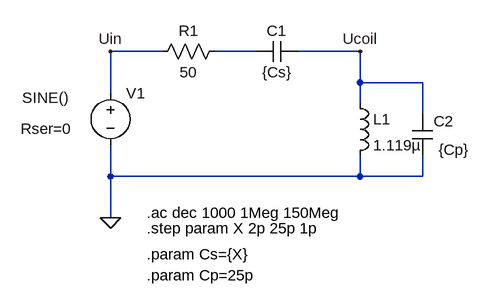
[diagram p0: schematic SeriesRLC-SeriesR.asc]
SeriesRLC-SeriesR.asc, the LTspice schematic file:
Version 4
SHEET 1 880 708
WIRE 224 48 144 48
WIRE 368 48 304 48
WIRE 528 48 432 48
WIRE 528 96 528 48
WIRE 624 96 528 96
WIRE 144 112 144 48
WIRE 528 128 528 96
WIRE 624 144 624 96
WIRE 144 240 144 192
WIRE 528 240 528 208
WIRE 528 240 144 240
WIRE 624 240 624 208
WIRE 624 240 528 240
WIRE 144 304 144 240
FLAG 144 304 0
FLAG 528 48 Ucoil
FLAG 144 48 Uin
SYMBOL ind 512 112 R0
SYMATTR InstName L1
SYMATTR Value 1.119µ
SYMATTR SpiceLine Rser=0.1 Cpar=38f
SYMBOL voltage 144 96 R0
WINDOW 39 -138 71 Left 2
WINDOW 3 -136 23 Left 2
SYMATTR SpiceLine Rser=0
SYMATTR Value SINE()
SYMATTR Value2 AC 1
SYMATTR InstName V1
SYMBOL cap 432 32 R90
WINDOW 0 0 32 VBottom 2
WINDOW 3 32 32 VTop 2
SYMATTR InstName C1
SYMATTR Value {Cs}
SYMBOL cap 640 208 R180
WINDOW 0 -32 53 Left 2
WINDOW 3 -56 9 Left 2
SYMATTR InstName C2
SYMATTR Value {Cp}
SYMATTR SpiceLine Rser=0.1
SYMBOL res 320 32 R90
WINDOW 0 0 56 VBottom 2
WINDOW 3 32 56 VTop 2
SYMATTR InstName R1
SYMATTR Value 50
TEXT 200 296 Left 2 !.ac dec 1000 1Meg 150Meg
TEXT 200 320 Left 2 !.step param X 2p 25p 1p
TEXT 200 360 Left 2 !.param Cs={X}
TEXT 200 392 Left 2 !.param Cp=25p

The netlist it stands for:
* SeriesRLC-SeriesR.asc
L1 Ucoil 0 1.119µ Rser=0.1 Cpar=38f
V1 Uin 0 SINE() AC 1 Rser=0
C1 Ucoil N001 {Cs}
C2 0 Ucoil {Cp} Rser=0.1
R1 N001 Uin 50
.ac dec 1000 1Meg 150Meg
.step param X 2p 25p 1p
.param Cs={X}
.param Cp=25p
.backanno
.end